# EAGLE design midi-footcontroller (EAGLE 7.0.0)
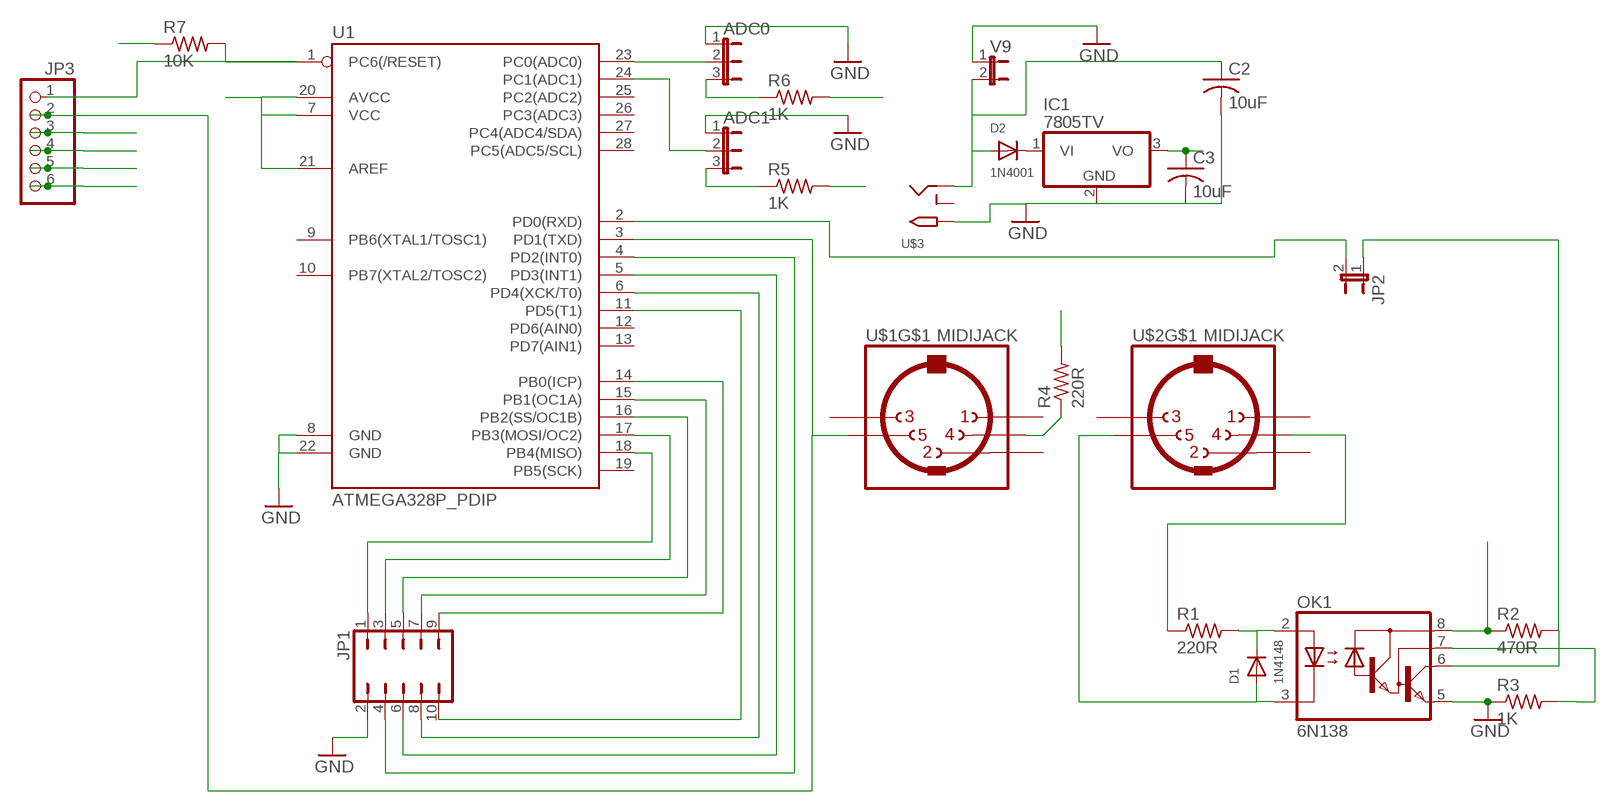
[diagram p0: schematic, sheet 1]

## Parts
ADC0  JP2E  [JP2]
ADC1  JP2E  [JP2]
C2  10uF  C-US025-025X050  [C025-025X050]
C3  10uF  C-US025-025X050  [C025-025X050]
D1  1N4148  DIODEDO-1N4148  [DO-1N4148]
D2  1N4001  DIODEDO-1N4148  [DO-1N4148]
IC1  7805TV  [TO220V]
JP1  JP5Q  [JP5Q]
JP2  JP1E  [JP1]
JP3  PINHD-1X6LOCK  [1X06-BIGLOCK]
OK1  6N138  [DIL08]
R1  220R  R-US_0207/9  [0207/9]
R2  470R  R-US_0207/9  [0207/9]
R3  1K  R-US_0207/9  [0207/9]
R4  220R  R-US_0207/9  [0207/9]
R5  1K  R-US_0207/9  [0207/9]
R6  1K  R-US_0207/9  [0207/9]
R7  10K  R-US_0207/9  [0207/9]
U1  ATMEGA328P_PDIP  [DIL28-3]
U$1  MIDIJACK  [CP-2350]
U$2  MIDIJACK  [CP-2350]
U$3  2.1MMJACKTHM  [PJ-102A]
V9  JP1E  [JP1]

## Nets
GND: ADC0.1 ADC1.1 C2.2 C3.2 IC1.2(GND) JP1.2 JP3.5 OK1.5(GND) R3.1 U1.8(GND) U1.22(GND) U$3.TIP V9.1
N$1: D1.C OK1.2(A) R1.2
N$2: D1.A OK1.3(C) U$2.5
N$3: R1.1 U$2.4
N$4: D2.C IC1.1(VI)
N$5: OK1.7(VB) R3.2
N$6: R4.1 U$1.4
N$8: ADC0.2 U1.23(PC0(ADC0))
N$9: JP1.10 U1.11(PD5(T1))
N$10: ADC1.2 U1.24(PC1(ADC1))
N$11: ADC0.3 R6.1
N$12: ADC1.3 R5.1
N$13: JP1.8 U1.6(PD4(XCK/T0))
N$14: JP1.6 U1.5(PD3(INT1))
N$15: JP1.4 U1.4(PD2(INT0))
N$16: JP1.1 U1.18(PB4(MISO))
N$17: JP2.1 OK1.6(VO) R2.2
N$18: JP1.9 U1.14(PB0(ICP))
N$19: JP1.7 U1.15(PB1(OC1A))
N$20: JP1.5 U1.16(PB2(SS/OC1B))
N$21: JP1.3 U1.17(PB3(MOSI/OC2))
N$22: JP3.1 R7.2 U1.1(PC6(/RESET))
N$26: JP3.6
RXD: JP2.2 JP3.3 U1.2(PD0(RXD))
TXD: JP3.2 U1.3(PD1(TXD)) U$1.5
V5: C3.1 IC1.3(VO) JP3.4 OK1.8(VCC) R2.1 R4.2 R5.2 R6.2 R7.1 U1.7(VCC) U1.20(AVCC) U1.21(AREF)
V9: C2.1 D2.A U$3.RING V9.2
Unconnected: U1.9(PB6(XTAL1/TOSC1)) U1.10(PB7(XTAL2/TOSC2)) U1.12(PD6(AIN0)) U1.13(PD7(AIN1)) U1.19(PB5(SCK)) U1.25(PC2(ADC2)) U1.26(PC3(ADC3)) U1.27(PC4(ADC4/SDA)) U1.28(PC5(ADC5/SCL)) U$1.1 U$1.2 U$1.3 U$1.PE1(MT) U$1.PE2(MT) U$1.PE(MT) U$1.PE@(MT) U$2.1 U$2.2 U$2.3 U$2.PE1(MT) U$2.PE2(MT) U$2.PE(MT) U$2.PE@(MT) U$3.RING_SW

## Library data of the parts
ADC0 ADC1 = jumper:JP2E: JUMPER
C2 C3 = adafruit:C-US: CAPACITOR, American symbol
D1 D2 = adafruit:DIODE: Diode SMADIODE - SMA Surface Mount Package 20V 1A Schottky Diode Digikey: 641-1014-6-ND DO-1N4148 - Through Hole Small Current Diode SOD-123 20V 1 A (.5mV Vf) Schottky Diode - Digikey: MBRX120TPMSCT-ND SOD-323 10V 570mA (.38mV Vf, 3ns) Schottky Diode - Digikey: ZLLS410CT-ND SOD-523 30V 30mA Schottky Diode (RB751S-40TE61) - Digikey: RB751S-40TE61CT-ND SOT23-R/W - SOT23 Package (R = Solder Paste/Reflow Ovens, W = Hand-Soldering) BAT54Film 40V 300mA - Digikey: 497-7162-1-ND
IC1 = linear:78*: Positive VOLTAGE REGULATOR Source: http://cache.national.com/ds/LM/LM78L05.pdf http://www.fairchildsemi.com/ds/LM/LM7805.pdf
JP1 = jumper:JP5Q: JUMPER
JP2 V9 = jumper:JP1E: JUMPER
JP3 = adafruit:PINHD-1X6: PIN HEADER
OK1 = optocoupler:6N138: MOTOROLA OPTO COUPLER; MF: VISHAY/TELEFUNKEN; MPN: 6N138; OC_FARNELL: 9860150; OC_NEWARK: 35K5294
R1-R7 = adafruit:R-US_: RESISTOR, American symbol
U1 = SparkFun-DigitalIC:ATMEGA328P_PDIP: uC used in the Arduino 32kb flash, 1k EEPROM, 2k SRAM This is the through-hole version of this chip.
U$1 U$2 = adafruit:MIDIJACK: DIN 5 jack also known as MIDI jack A modification of conn-hirshman:MAB5SH with two options for the grounding 'teeth'
U$3 = adafruit:2.1MMJACK: 2.1mm x 5.5mm THM DC jack with internal switch. Digikey part #PJ-102A, 4UCON part #05537 2.1mm x 5.5mm SMT DC jack with internal switch. Digikey part #PJ-002A-SMT, 4UCON part #03267 By microbuilder.eu & adafruit.com

## Board
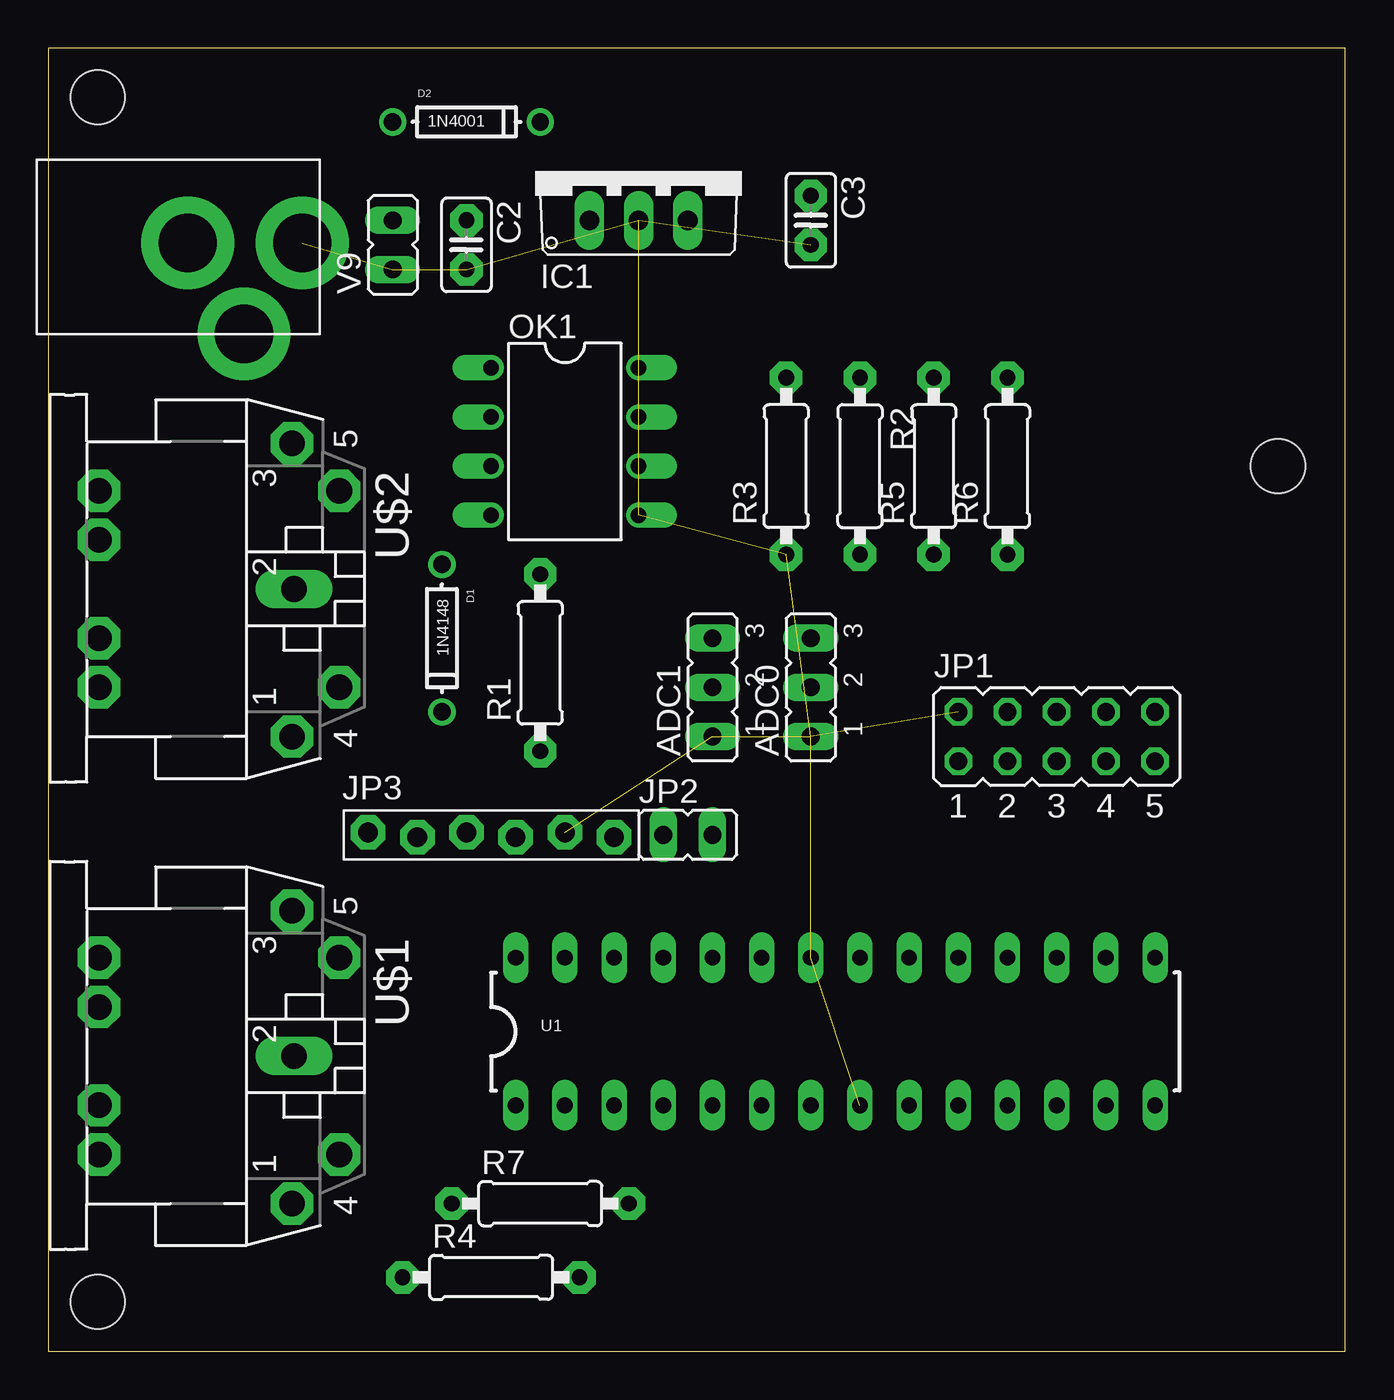
[diagram p1: board, top side]
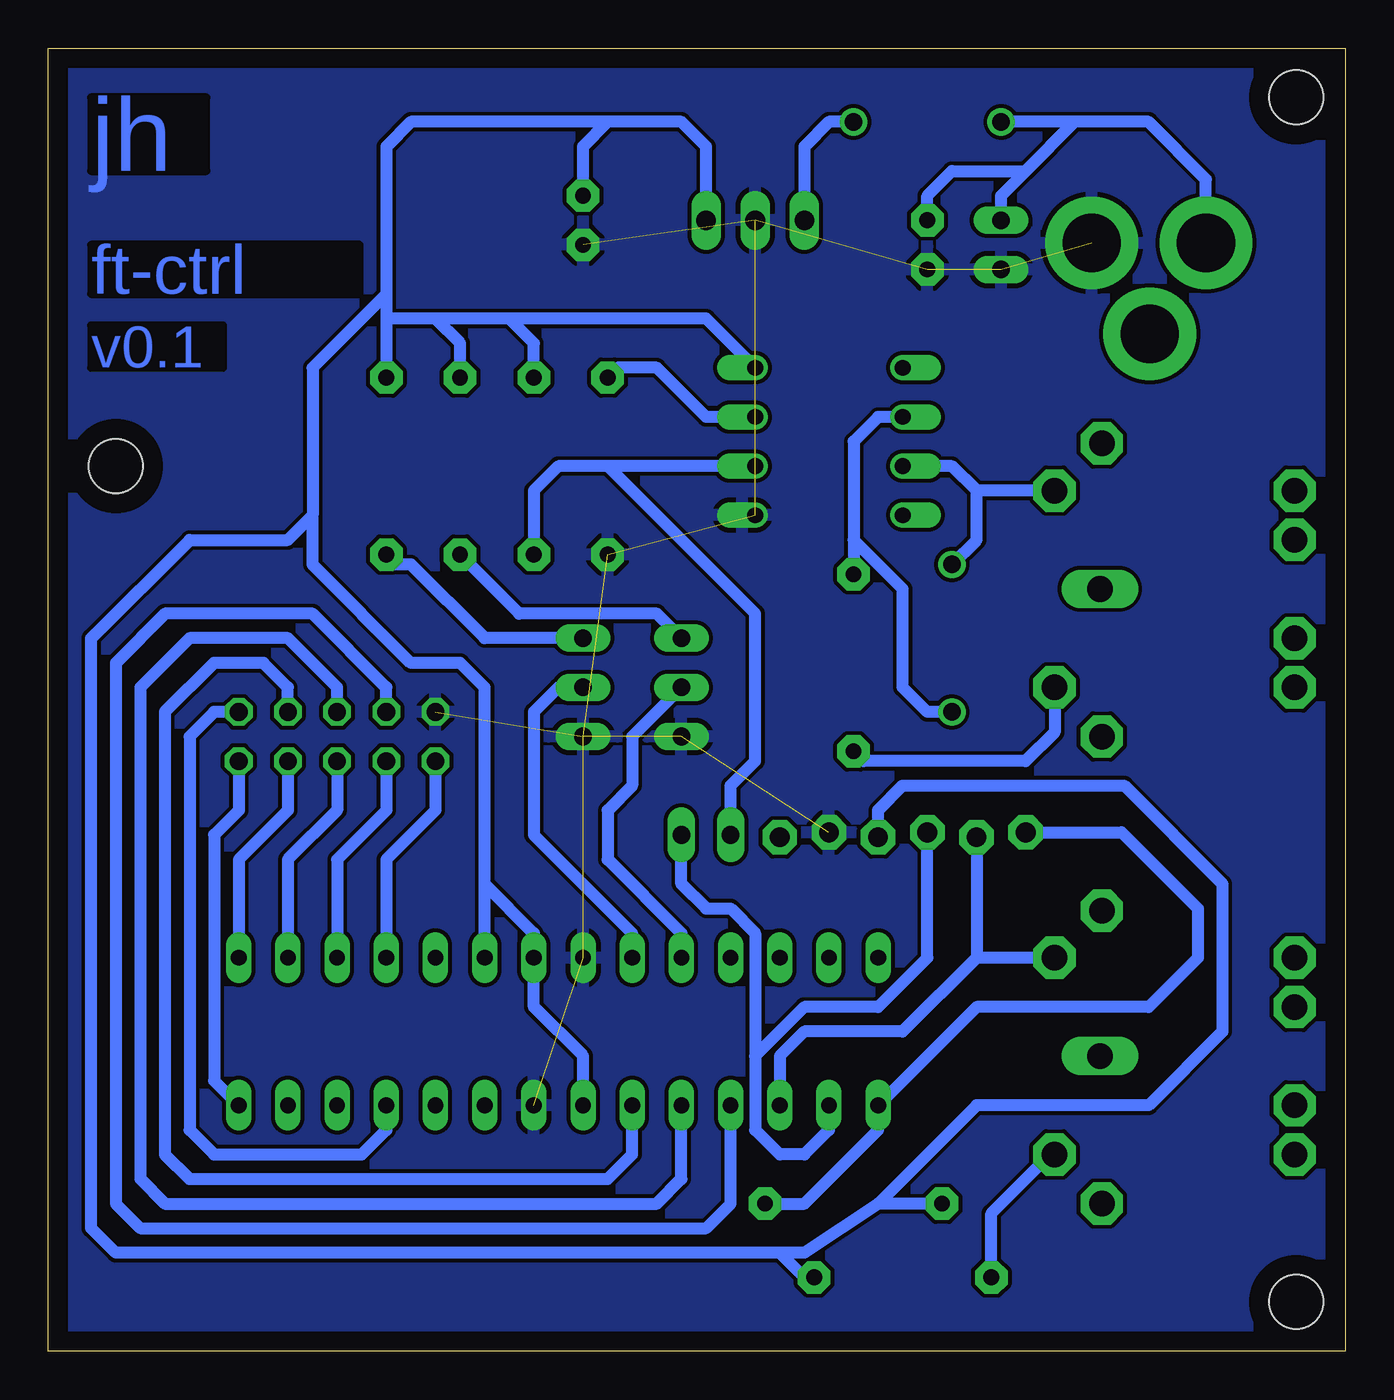
[diagram p2: board, bottom side, seen from below]

Size 66.98 x 67.3 mm. Coordinates in mm from the lower left corner, seen from the top.
Outline: 0,0 66.98,0 66.98,67.3 0,67.3 0,0
Copper layers (1*16): Top 0.035mm / dielectric 1.5mm / Bottom 0.035mm
Design rules "default": minimum track width 10mil, minimum drill 24mil, track to track 8mil, track to pad 8mil, pad to pad 8mil, via to via 8mil, smd to smd 8mil, copper to edge 40mil, drill to drill 8mil, minimum pad ring 10mil, minimum via ring 8mil, stop-mask expansion 4mil, vias tented up to drill 0mil, thermal gap 10mil
Holes 2.8 mm at 2.54,64.77 2.54,2.54 63.5,45.72

### Footprints (pad centres in the part's own frame; a part is rotated, then mirrored left to right if it is on the bottom)
JP2 = drill 0.914 long: 1 -2.54,0; 2 0,0; 3 2.54,0
C025-025X050 = drill 0.813 pad 1.676 octagon: 1 -1.27,0; 2 1.27,0
DO-1N4148 = drill 0.9: A -3.81,0; C 3.81,0
TO220V = drill 1.016 long: 1 -2.54,-2.54; 2 0,-2.54; 3 2.54,-2.54
JP5Q = drill 0.914 octagon: 1 -5.08,-1.27; 2 -5.08,1.27; 3 -2.54,-1.27; 4 -2.54,1.27; 5 0,-1.27; 6 0,1.27; 7 2.54,-1.27; 8 2.54,1.27; 9 5.08,-1.27; 10 5.08,1.27
JP1 = drill 0.914 long: 1 0,-1.27; 2 0,1.27
1X06-BIGLOCK = drill 1.016 pad 1.778 octagon: 1 -6.35,0.127; 2 -3.81,-0.127; 3 -1.27,0.127; 4 1.27,-0.127; 5 3.81,0.127; 6 6.35,-0.127
DIL08 = drill 0.813 offset: 1 -3.81,-3.81; 2 -1.27,-3.81; 3 1.27,-3.81; 4 3.81,-3.81; 5 3.81,3.81; 6 1.27,3.81; 7 -1.27,3.81; 8 -3.81,3.81
0207/9 = drill 0.813 pad 1.676 octagon: 1 -4.572,0; 2 4.572,0
DIL28-3 = drill 0.813 long: 1 -16.51,-3.81; 2 -13.97,-3.81; 3 -11.43,-3.81; 4 -8.89,-3.81; 5 -6.35,-3.81; 6 -3.81,-3.81; 7 -1.27,-3.81; 8 1.27,-3.81; 9 3.81,-3.81; 10 6.35,-3.81; 11 8.89,-3.81; 12 11.43,-3.81; 13 13.97,-3.81; 14 16.51,-3.81; 15 16.51,3.81; 16 13.97,3.81; 17 11.43,3.81; 18 8.89,3.81; 19 6.35,3.81; 20 3.81,3.81; 21 1.27,3.81; 22 -1.27,3.81; 23 -3.81,3.81; 24 -6.35,3.81; 25 -8.89,3.81; 26 -11.43,3.81; 27 -13.97,3.81; 28 -16.51,3.81
CP-2350 = drill 1.321 pad 2.184 octagon: 1 7.62,12.58; 3 -7.52,12.58; 4 5.08,15.02; 5 -5.08,15.02; PE -2.54,2.62; PE1 -5.08,2.62; PE2 5.08,2.62; PE@ 2.54,2.62 | drill 1.321 long: 2 0,12.68
PJ-102A = drill 3 pad 4.8: RING 0.1,-3.39; RING_SW -4.6,-6.29; TIP 0.1,-9.29

### Placement (x,y rotation side)
ADC0  39.37,34.29 90 top
ADC1  34.29,34.29 90 top
C2  21.59,57.15 270 top
C3  39.37,58.42 270 top
D1  20.32,36.83 270 top
D2  21.59,63.5 0 top
IC1  30.48,60.96 0 top
JP1  52.07,31.75 0 top
JP2  33.02,26.67 270 top
JP3  22.86,26.67 0 top
OK1  26.67,46.99 270 top
R1  25.4,35.56 90 top
R2  41.91,45.72 270 top
R3  38.1,45.72 90 top
R4  22.86,3.81 0 top
R5  45.72,45.72 90 top
R6  49.53,45.72 90 top
R7  25.4,7.62 0 top
U1  40.64,16.51 0 top
U$1  0,15.24 270 top
U$2  0,39.37 270 top
U$3  3.81,57.15 90 top
V9  17.78,57.15 0 top

### Tracks (layer width: path | path; a pad name or v marks a point on that pad's centre or on a via)
GND  (12 unrouted)
  pour Bottom: -2.54,74.93 69.85,74.93 69.85,0 -2.54,0
N$1
  Bottom 0.61: OK1.2 24.13,48.26 25.4,46.99 25.4,41.91 | 25.4,41.91 R1.2 | D1.C 21.59,33.02 22.86,34.29 22.86,39.37 25.4,41.91
N$2
  Bottom 0.61: OK1.3 20.32,45.72 19.05,44.45 | D1.A 19.05,41.91 19.05,44.45 | U$2.5 19.05,44.45
N$3
  Bottom 0.61: U$2.4 15.02,31.97 16.51,30.48 24.89,30.48 R1.1
N$4
  Bottom 0.61: IC1.1 27.94,62.23 26.67,63.5 D2.C
N$5
  Bottom 0.61: OK1.7 33.02,48.26 35.56,50.8 37.59,50.8 R3.2
N$6
  Bottom 0.61: U$1.4 15.24,10.16 18.29,7.11 R4.1
N$8
  Bottom 0.61: U1.23 36.83,21.59 41.91,26.67 41.91,33.02 40.64,34.29 ADC0.2
N$9
  Bottom 0.61: JP1.10 58.42,33.02 59.69,31.75 59.69,11.43 58.42,10.16 50.8,10.16 49.53,11.43 U1.11
N$10
  Bottom 0.61: ADC1.2 36.83,31.75 36.83,29.21 38.1,27.94 38.1,25.4 34.29,21.59 U1.24
N$11
  Bottom 0.61: ADC0.3 44.45,36.83 48.26,40.64 49.02,40.64 R6.1
N$12
  Bottom 0.61: ADC1.3 35.56,38.1 42.67,38.1 R5.1
N$13
  Bottom 0.61: JP1.8 54.61,34.29 55.88,35.56 58.42,35.56 60.96,33.02 60.96,10.16 59.69,8.89 38.1,8.89 36.83,10.16 U1.6
N$14
  Bottom 0.61: JP1.6 52.07,34.29 54.61,36.83 59.69,36.83 62.23,34.29 62.23,8.89 60.96,7.62 35.56,7.62 34.29,8.89 U1.5
N$15
  Bottom 0.61: JP1.4 49.53,34.29 53.34,38.1 60.96,38.1 63.5,35.56 63.5,7.62 62.23,6.35 33.02,6.35 31.75,7.62 U1.4
N$16
  Bottom 0.61: JP1.1 46.99,27.94 49.53,25.4 U1.18
N$17
  Bottom 0.61: OK1.6 38.1,45.72 | 38.1,45.72 40.64,45.72 41.91,44.45 R2.2 | JP2.1 31.75,29.21 30.48,30.48 30.48,38.1 38.1,45.72
N$18
  Bottom 0.61: JP1.9 57.15,27.94 58.42,26.67 58.42,13.97 U1.14
N$19
  Bottom 0.61: JP1.7 54.61,27.94 57.15,25.4 U1.15
N$20
  Bottom 0.61: JP1.5 52.07,27.94 54.61,25.4 U1.16
N$21
  Bottom 0.61: JP1.3 49.53,27.94 52.07,25.4 U1.17
N$22
  Bottom 0.61: R7.2 27.94,7.62 24.13,11.43 U1.1 19.05,17.78 10.16,17.78 7.62,20.32 7.62,22.86 11.56,26.8 JP3.1
RXD
  Bottom 0.61: U1.2 26.67,11.43 27.94,10.16 29.21,10.16 30.48,11.43 30.48,15.24 | JP2.2 34.29,24.13 33.02,22.86 31.75,22.86 30.48,21.59 30.48,15.24 | JP3.3 21.59,20.32 24.13,17.78 27.94,17.78 30.48,15.24
TXD
  Bottom 0.61: U1.3 29.21,15.24 27.94,16.51 22.86,16.51 19.05,20.32 | U$1.5 19.05,20.32 | JP3.2 19.05,20.32
V5
  Bottom 0.61: IC1.3 33.02,62.23 34.29,63.5 38.1,63.5 | 38.1,63.5 48.26,63.5 49.53,62.23 49.53,54.61 | 49.53,54.61 49.53,53.34 | 49.53,53.34 R6.2 | C3.1 39.37,62.23 38.1,63.5 | R5.2 45.72,52.07 46.99,53.34 | 46.99,53.34 49.53,53.34 | R2.1 41.91,52.07 43.18,53.34 | 43.18,53.34 46.99,53.34 | OK1.8 33.02,53.34 43.18,53.34 | 39.37,13.97 U1.7 39.37,15.24 41.91,17.78 U1.21 41.91,21.59 44.45,24.13 | U1.20 44.45,24.13 | 44.45,24.13 44.45,34.29 45.72,35.56 48.26,35.56 53.34,40.64 53.34,43.18 | 49.53,54.61 53.34,50.8 53.34,43.18 | 29.21,5.08 27.94,5.08 24.13,7.62 | 29.21,5.08 63.5,5.08 64.77,6.35 64.77,36.83 59.69,41.91 54.61,41.91 53.34,43.18 | R7.1 24.13,7.62 | JP3.4 24.13,27.94 22.86,29.21 11.43,29.21 6.35,24.13 6.35,16.51 10.16,12.7 19.05,12.7 24.13,7.62 | R4.2 27.94,3.81 29.21,5.08
V9
  Bottom 0.61: U$3.RING 7.2,60.54 10.16,63.5 13.97,63.5 | 13.97,63.5 D2.A | C2.1 21.59,59.69 20.32,60.96 16.51,60.96 | V9.2 17.78,59.69 16.51,60.96 | 16.51,60.96 13.97,63.5

### Text on the board
Bottom: jh | ft-ctrl | v0.1